# EAGLE design CD_Diode_Bleed_Resistor_brd (EAGLE 7.6.0)
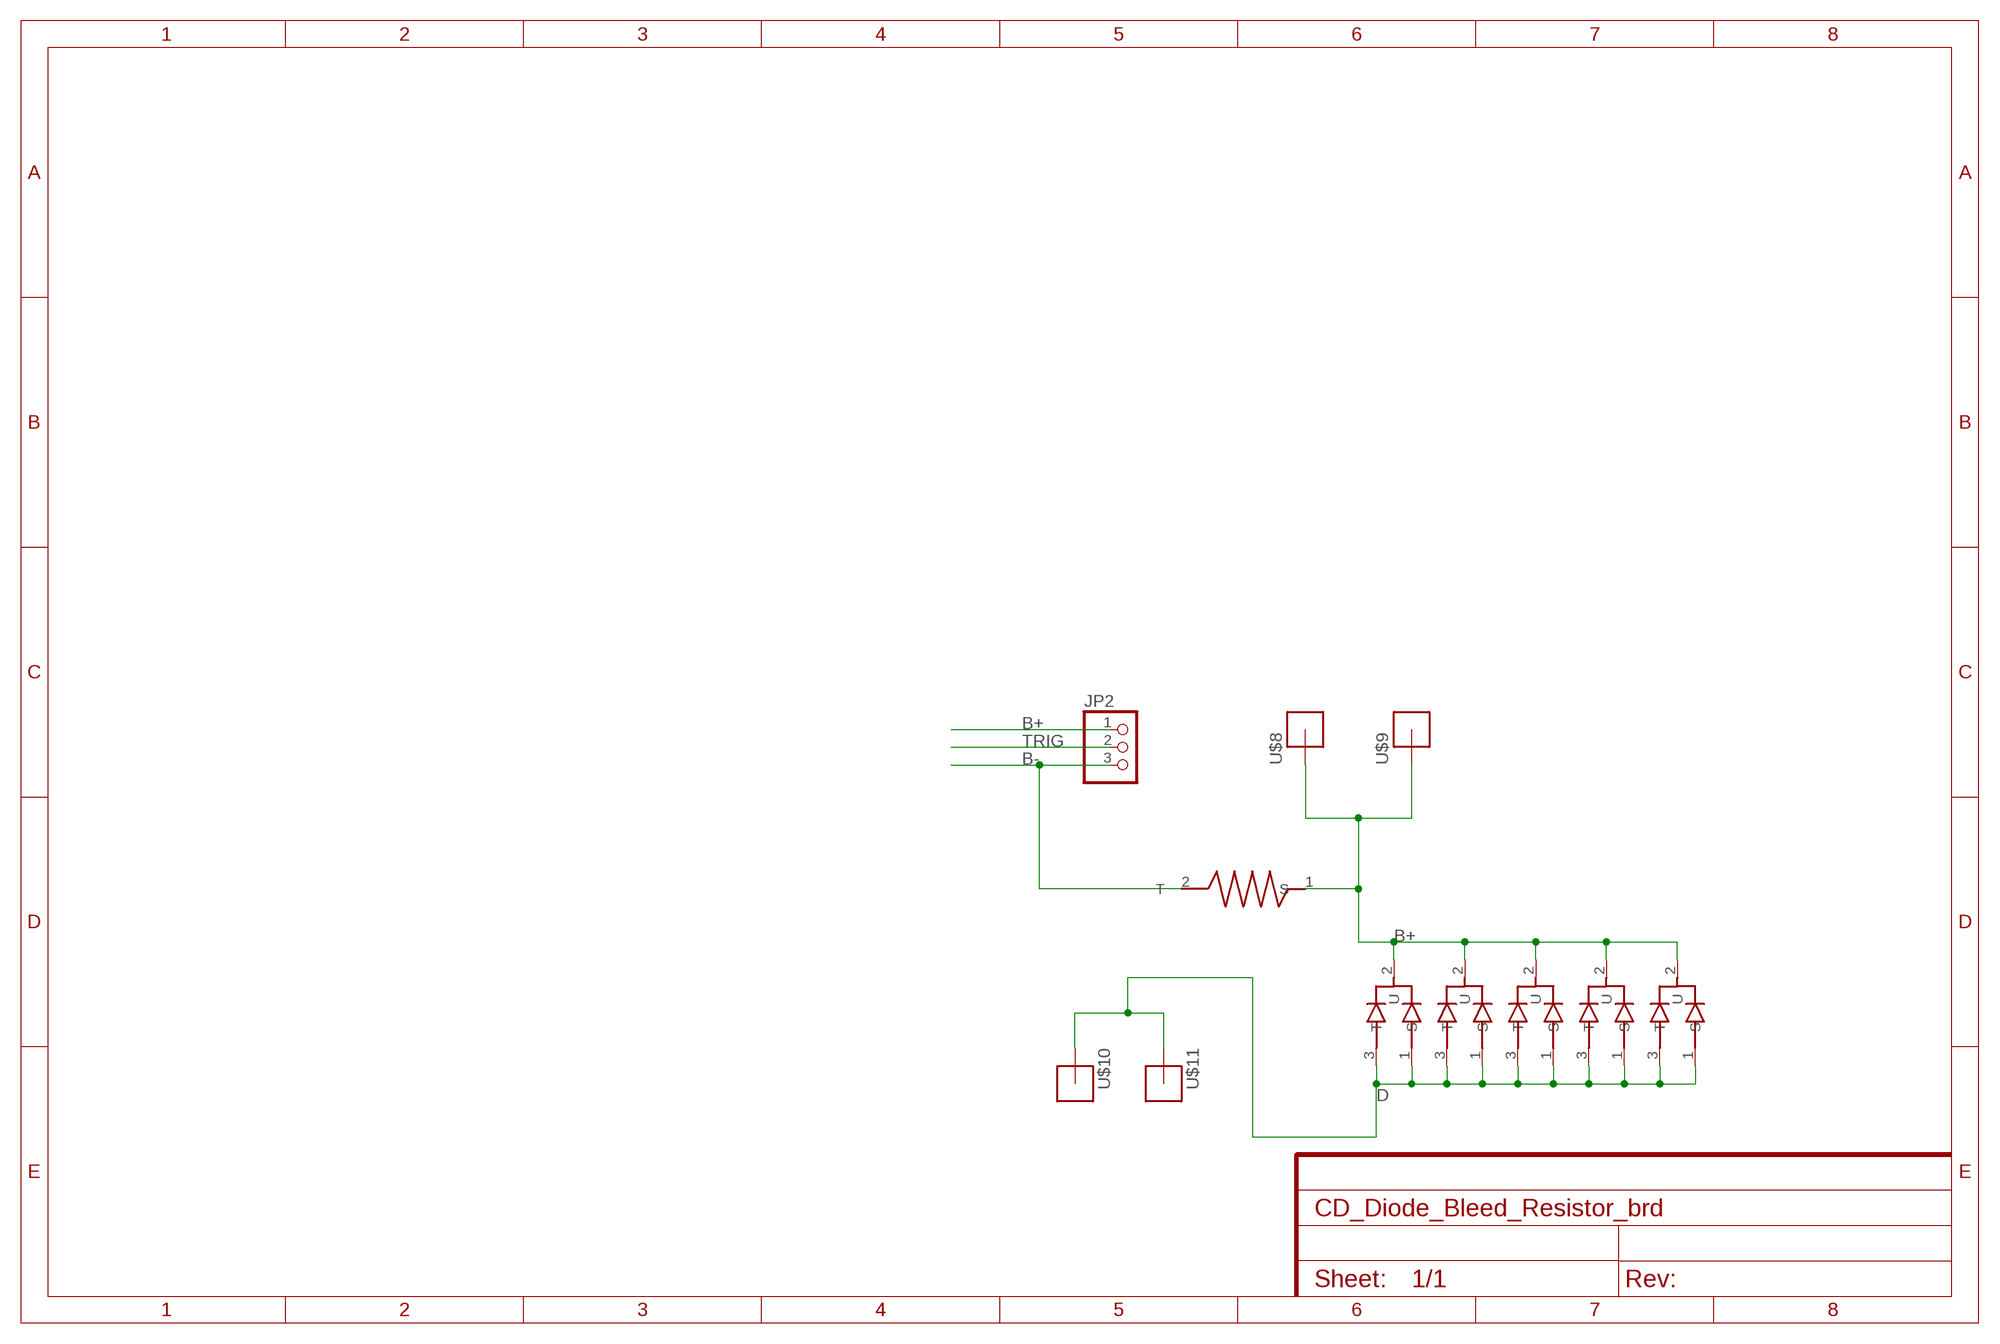
[diagram p0: schematic, sheet 1]

## Parts
JP2  PINHD-1X3/90  [1X03/90]
U$1  STTH6002CW  [TO-247]
U$2  STTH6002CW  [TO-247]
U$3  STTH6002CW  [TO-247]
U$4  STTH6002CW  [TO-247]
U$5  STTH6002CW  [TO-247]
U$7  RESISTOR_5W_1INCH  [RESISTOR_1INCH_5W]
U$8  BIG_PINHEADX110-32  [M6_PINHEAD]
U$9  BIG_PINHEADX110-32  [M6_PINHEAD]
U$10  BIG_PINHEADX110-32  [M6_PINHEAD]
U$11  BIG_PINHEADX110-32  [M6_PINHEAD]

## Nets
B+: JP2.1 U$1.2(U) U$2.2(U) U$3.2(U) U$4.2(U) U$5.2(U) U$7.1(S) U$8.P$1 U$9.P$1
B-: JP2.3 U$7.2(T)
D: U$1.1(S) U$1.3(T) U$2.1(S) U$2.3(T) U$3.1(S) U$3.3(T) U$4.1(S) U$4.3(T) U$5.1(S) U$5.3(T) U$10.P$1 U$11.P$1
TRIG: JP2.2

## Library data of the parts
JP2 = pinhead:PINHD-1X3: PIN HEADER
U$1-U$5 = _my-parts:STTH6002CW
U$7 = _my-parts:RESISTOR_5W_1INCH
U$8-U$11 = _my-parts:BIG_PINHEADX1

## Board
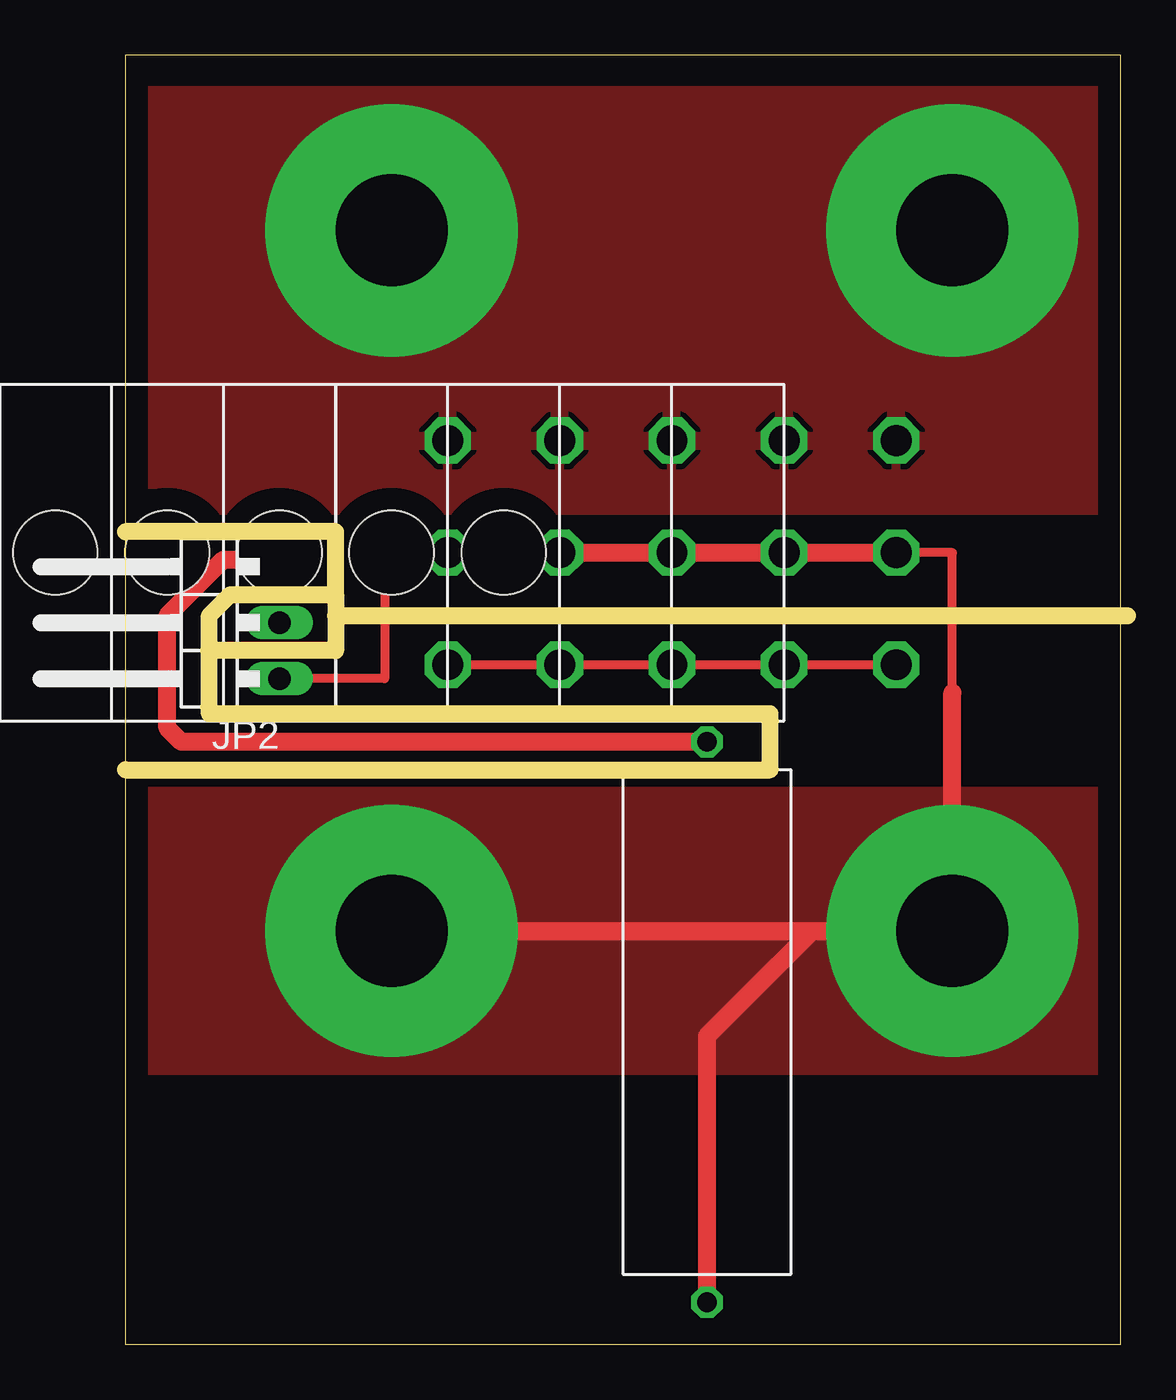
[diagram p1: board, top side]
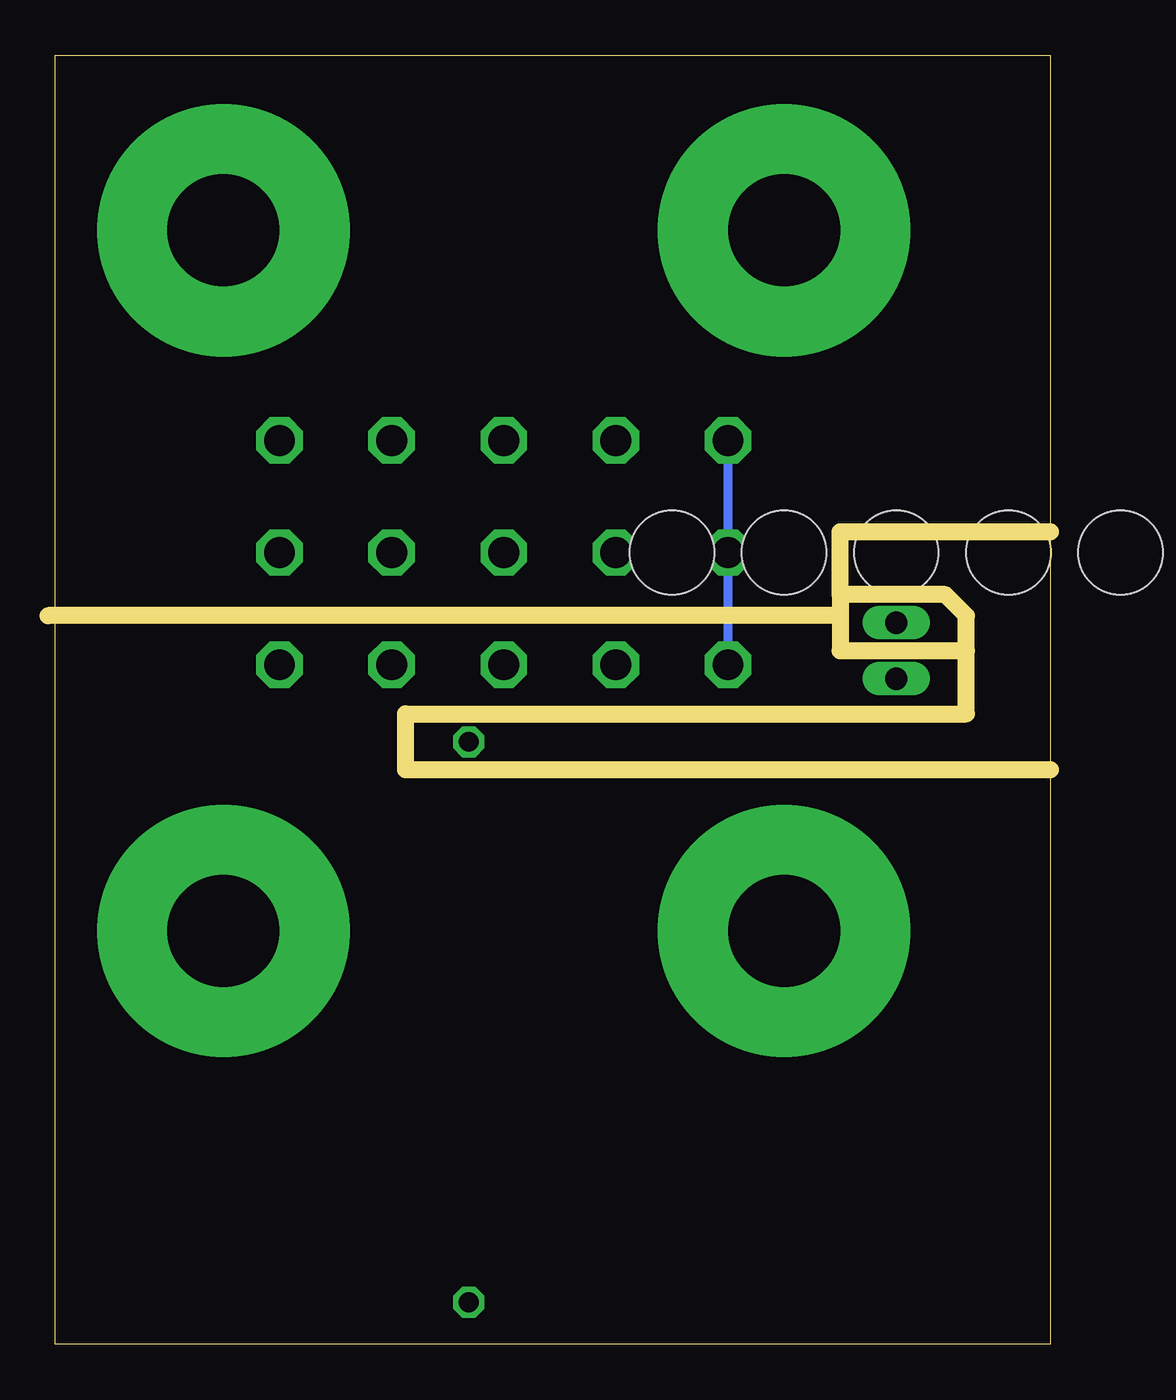
[diagram p2: board, bottom side, seen from below]

Size 45.09 x 58.42 mm. Coordinates in mm from the lower left corner, seen from the top.
Outline: 0,0 45.09,0 45.09,58.42 0,58.42 0,0
Copper layers (1*16): Top 0.035mm / dielectric 1.5mm / Bottom 0.035mm
Design rules "default": minimum track width 10mil, minimum drill 24mil, track to track 8mil, track to pad 8mil, pad to pad 8mil, via to via 8mil, smd to smd 8mil, copper to edge 40mil, drill to drill 8mil, minimum pad ring 10mil, minimum via ring 8mil, stop-mask expansion 4mil, vias tented up to drill 0mil, thermal gap 10mil
Milling: 13 lines

### Footprints (pad centres in the part's own frame; a part is rotated, then mirrored left to right if it is on the bottom)
1X03/90 = drill 1.016 long: 1 -2.54,-3.81; 2 0,-3.81; 3 2.54,-3.81
TO-247 = drill 1.4 octagon: 1 -5.08,0; 2 0,0; 3 5.08,0 | hole 3.81: 0,17.78
RESISTOR_1INCH_5W = drill 0.9 octagon: 1 -12.7,0; 2 12.7,0
M6_PINHEAD = drill 5.08 pad 11.43: P$1 0,0

### Placement (x,y rotation side)
JP2  3.17,32.7 90 top
U$1  19.68,35.88 90 top
U$2  14.61,35.88 90 top
U$3  34.92,35.88 90 top
U$4  24.77,35.88 90 top
U$5  29.84,35.88 90 top
U$7  26.35,14.61 90 top
U$8  37.47,18.73 0 top
U$9  12.06,18.73 0 top
U$10  37.47,50.48 0 top
U$11  12.06,50.48 0 top

### Tracks (layer width: path | path; a pad name or v marks a point on that pad's centre or on a via)
B+
  Top 0.406: 37.47,29.53 37.47,35.88 U$3.2 | U$2.2 11.75,35.88 11.75,30.16 JP2.1
  Top 0.813: U$2.2 U$1.2 U$4.2 U$5.2 U$3.2 | U$9.P$1 31.11,18.73 | 31.11,18.73 37.15,18.73 37.47,19.05 37.47,29.53 | U$7.1 26.35,13.97 31.11,18.73
  pour Top: 0,25.08 45.09,25.08 45.09,12.38 0,12.38
B-
  Top 0.813: U$7.2 2.54,27.3 1.91,27.94 1.91,33.02 4.45,35.56 6.67,35.56 JP2.3
D
  Top 0.406: U$2.1 U$1.1 U$4.1 25.08,30.8 U$5.1 U$3.1
  Bottom 0.406: U$2.1 U$2.3
  pour Top: -0.64,56.83 44.45,56.83 44.45,37.78 -0.64,37.78
  pour Top: 39.37,49.53 39.37,40.64 12.06,40.64 12.06,50.16 39.37,50.16